# EAGLE schematic Teensy_v1 (EAGLE 7.7.0)
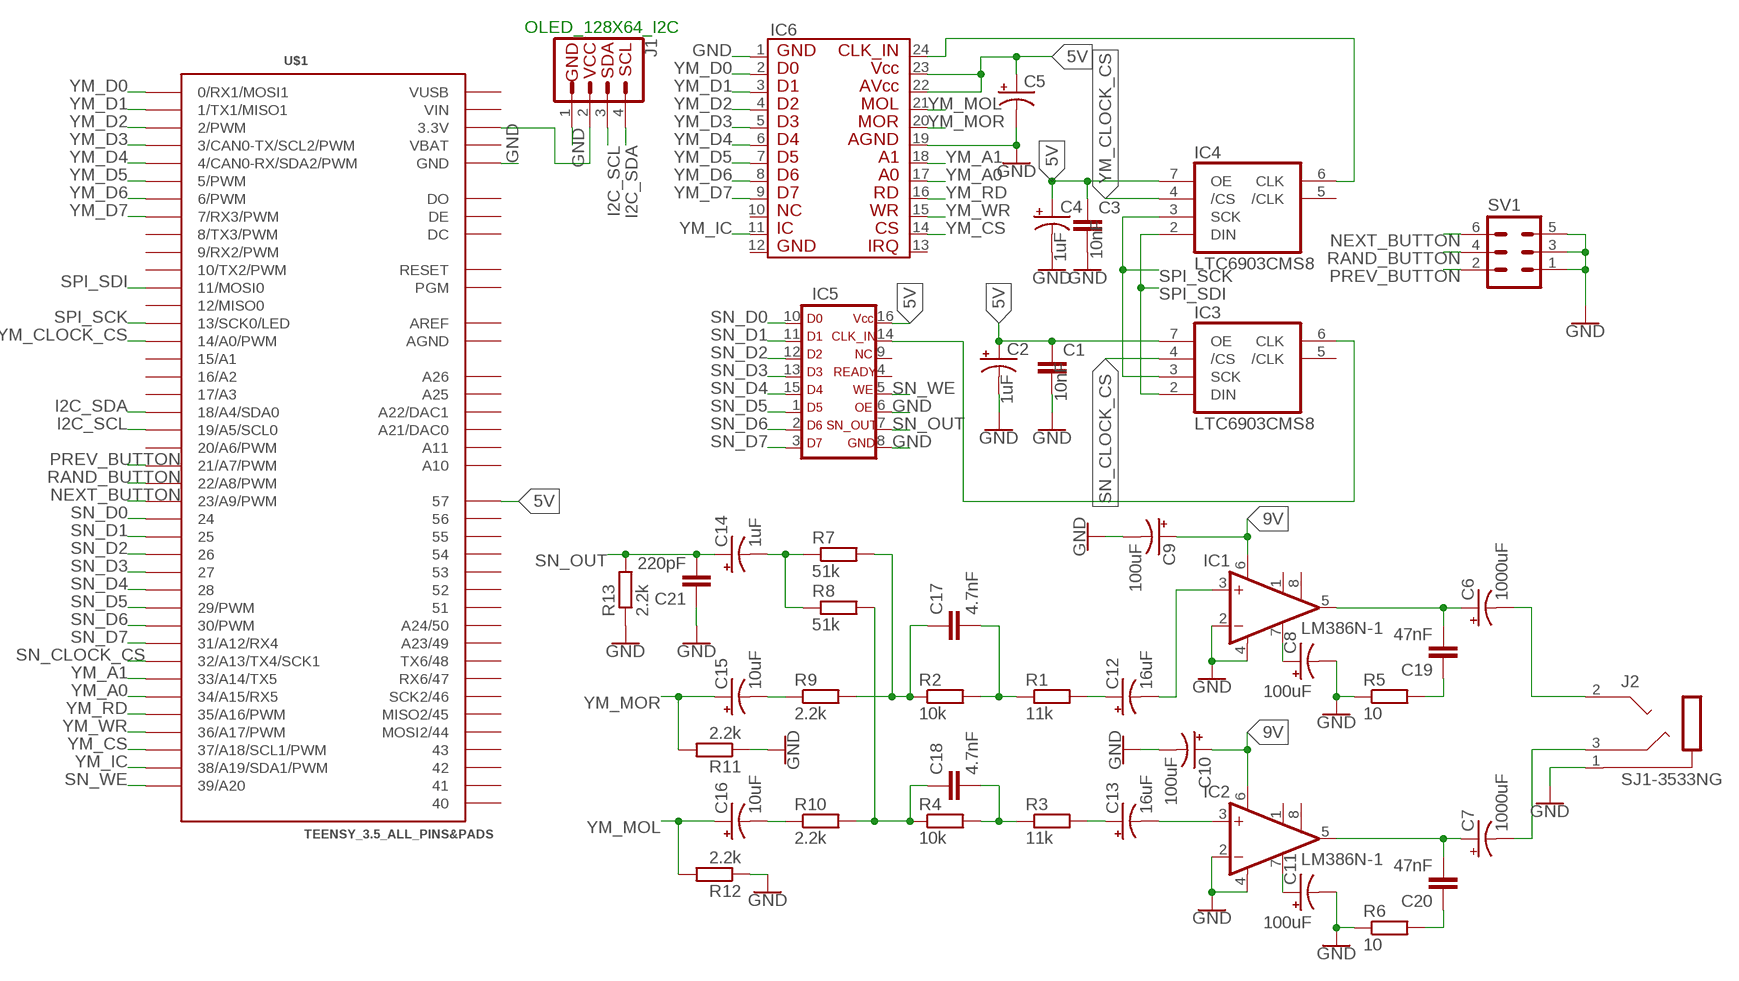
[diagram p0: schematic, sheet 1]

## Parts
C1  10nF  C-EU025-025X050  [C025-025X050]
C2  1uF  CPOL-USE2-5  [E2-5]
C3  10nF  C-EU025-025X050  [C025-025X050]
C4  1uF  CPOL-USE2-5  [E2-5]
C5  1000uF  CPOL-USE5-10.5  [E5-10,5]
C6  1000uF  CPOL-USE5-10.5  [E5-10,5]
C7  1000uF  CPOL-USE5-10.5  [E5-10,5]
C8  100uF  CPOL-USE2-5  [E2-5]
C9  100uF  CPOL-USE2-5  [E2-5]
C10  100uF  CPOL-USE2-5  [E2-5]
C11  100uF  CPOL-USE2-5  [E2-5]
C12  16uF  CPOL-USE5-10.5  [E5-10,5]
C13  16uF  CPOL-USE5-10.5  [E5-10,5]
C14  1uF  CPOL-USE2-5  [E2-5]
C15  10uF  CPOL-USE2-5  [E2-5]
C16  10uF  CPOL-USE2-5  [E2-5]
C17  4.7nF  C-EU025-025X050  [C025-025X050]
C18  4.7nF  C-EU025-025X050  [C025-025X050]
C19  47nF  C-EU025-025X050  [C025-025X050]
C20  47nF  C-EU025-025X050  [C025-025X050]
C21  220pF  C-EU025-025X050  [C025-025X050]
IC1  LM386N-1  [DIL08]
IC2  LM386N-1  [DIL08]
IC3  LTC6903CMS8  [MSOP8]
IC4  LTC6903CMS8  [MSOP8]
IC5  SN76489*  [SOCKET-16]
IC6  YM2612-6  [DIL24-6]
J1  I2C_STANDARD  [1X04]
J2  SJ1-3533NG  [SJ1-3533NG]
R1  11k  R-EU_0204/7  [0204/7]
R2  10k  R-EU_0204/7  [0204/7]
R3  11k  R-EU_0204/7  [0204/7]
R4  10k  R-EU_0204/7  [0204/7]
R5  10  R-EU_0204/7  [0204/7]
R6  10  R-EU_0204/7  [0204/7]
R7  51k  R-EU_0204/7  [0204/7]
R8  51k  R-EU_0204/7  [0204/7]
R9  2.2k  R-EU_0204/7  [0204/7]
R10  2.2k  R-EU_0204/7  [0204/7]
R11  2.2k  R-EU_0204/7  [0204/7]
R12  2.2k  R-EU_0204/7  [0204/7]
R13  2.2k  R-EU_0204/7  [0204/7]
SV1  MA03-2  [MA03-2]
U$1  TEENSY_3.5_ALL_PINS&PADS  [TEENSY_3.5_ALL_PINS&PADS]

## Nets
5V: C1.1 C2.+ C3.1 C4.+ C5.+ IC3.7(OE) IC4.7(OE) IC5.16(V) IC6.22 IC6.23 U$1.57
9V: C9.+ C10.+ IC1.6(VS) IC2.6(VS)
GND: C1.2 C2.- C3.2 C4.- C5.- C8.- C9.- C10.- C11.- C21.1 IC1.2(-IN) IC1.4(GND) IC2.2(-IN) IC2.4(GND) IC5.6(OE) IC5.8(GND) IC6.1 IC6.19 J1.1 J2.1(S) R5.1 R6.1 R11.1 R12.1 R13.1 SV1.1 SV1.3 SV1.5 U$1.GND U$1.GND1(GND) U$1.GND2(GND) U$1.GND3(GND) U$1.GND4(GND) U$1.GND5(GND) U$1.GND6(GND)
I2C_SCL: J1.3 U$1.19/A5(19/A5/SCL0)
I2C_SDA: J1.4 U$1.18/A4(18/A4/SDA0)
N$1: J1.2 U$1.3.3V U$1.3.3V2(3.3V) U$1.3.3V3(3.3V) U$1.3.3V4(3.3V)
N$2: IC4.6(CLK) IC6.24
N$3: C12.+ R1.2
N$4: C7.- J2.3(R)
N$5: C6.- J2.2(T)
N$6: C6.+ C19.2 IC1.5(OUT)
N$7: C7.+ C20.2 IC2.5(OUT)
N$8: C8.+ IC1.7(BYPASS)
N$9: C11.+ IC2.7(BYPASS)
N$10: C13.+ R3.2
N$11: IC3.6(CLK) IC5.14(CLK)
N$12: C19.1 R5.2
N$13: C17.2 R1.1 R2.2
N$14: C18.2 R3.1 R4.2
N$15: C12.- IC1.3(+IN)
N$16: C13.- IC2.3(+IN)
N$17: C20.1 R6.2
N$19: C17.1 R2.1 R7.2 R9.2
N$21: C18.1 R4.1 R8.2 R10.2
N$22: C14.- R7.1 R8.1
N$23: C15.- R9.1
N$24: C16.- R10.1
NEXT_BUTTON: U$1.23/A9(23/A9/PWM)
PREV_BUTTON: U$1.21/A7(21/A7/PWM)
RAND_BUTTON: U$1.22/A8(22/A8/PWM)
SN_CLOCK_CS: IC3.4(/CS) U$1.32/A13(32/A13/TX4/SCK1)
SN_D0: IC5.10(D0) U$1.24
SN_D1: IC5.11(D1) U$1.25
SN_D2: IC5.12(D2) U$1.26
SN_D3: IC5.13(D3) U$1.27
SN_D4: IC5.15(D4) U$1.28
SN_D5: IC5.1(D5) U$1.29(29/PWM)
SN_D6: IC5.2(D6) U$1.30(30/PWM)
SN_D7: IC5.3(D7) U$1.31/A12(31/A12/RX4)
SN_OUT: C14.+ C21.2 IC5.7(SN) R13.2
SN_WE: IC5.5(WE) U$1.39/A20
SPI_SCK: IC3.3(SCK) IC4.3(SCK) U$1.13(13/SCK0/LED)
SPI_SDI: IC3.2(DIN) IC4.2(DIN) U$1.11(11/MOSI0)
YM_A0: IC6.17 U$1.34/A15(34/A15/RX5)
YM_A1: IC6.18 U$1.33/A14(33/A14/TX5)
YM_CLOCK_CS: IC4.4(/CS) U$1.14/A0(14/A0/PWM)
YM_CS: IC6.14 U$1.37/A18(37/A18/SCL1/PWM)
YM_D0: IC6.2 U$1.0(0/RX1/MOSI1)
YM_D1: IC6.3 U$1.1(1/TX1/MISO1)
YM_D2: IC6.4 U$1.2(2/PWM)
YM_D3: IC6.5 U$1.3(3/CAN0-TX/SCL2/PWM)
YM_D4: IC6.6 U$1.4(4/CAN0-RX/SDA2/PWM)
YM_D5: IC6.7 U$1.5(5/PWM)
YM_D6: IC6.8 U$1.6(6/PWM)
YM_D7: IC6.9 U$1.7(7/RX3/PWM)
YM_IC: IC6.11 U$1.38/A19(38/A19/SDA1/PWM)
YM_MOL: C16.+ IC6.21 R12.2
YM_MOR: C15.+ IC6.20 R11.2
YM_RD: IC6.16 U$1.35/A16(35/A16/PWM)
YM_WR: IC6.15 U$1.36/A17(36/A17/PWM)
Unconnected: IC1.1(GAIN) IC1.8(GAIN) IC2.1(GAIN) IC2.8(GAIN) IC3.5(/CLK) IC4.5(/CLK) IC5.4(RDY) IC5.9(NC) IC6.10 IC6.12 IC6.13 SV1.2 SV1.4 SV1.6 U$1.8(8/TX3/PWM) U$1.9(9/RX2/PWM) U$1.10(10/TX2/PWM) U$1.12(12/MISO0) U$1.15/A1 U$1.16/A2 U$1.17/A3 U$1.20/A6(20/A6/PWM) U$1.40 U$1.41 U$1.42 U$1.43 U$1.44(MOSI2/44) U$1.45(MISO2/45) U$1.46(SCK2/46) U$1.47(RX6/47) U$1.48(TX6/48) U$1.49(A23/49) U$1.50(A24/50) U$1.51 U$1.52 U$1.53 U$1.54 U$1.55 U$1.56 U$1.A10 U$1.A11 U$1.A21(A21/DAC0) U$1.A22(A22/DAC1) U$1.A25 U$1.A26 U$1.DC U$1.DE U$1.DO U$1.PGM U$1.RESET

## Notes on the sheet
- OLED_128X64_I2C

## Power pins joined to a net without a drawn wire
AGND: U$1.AGND
AREF: U$1.AREF
GND: IC3.1(GND) IC4.1(GND)
VBAT: U$1.VBAT
VCC: IC3.8(VCC) IC4.8(VCC)
VIN: U$1.VIN
VUSB: U$1.VUSB

## Library data of the parts
C1 C3 C17-C21 = resistor:C-EU: CAPACITOR, European symbol
C2 C4-C16 = resistor:CPOL-US: POLARIZED CAPACITOR, American symbol
IC1 IC2 = linear:LM386?-*: Low Voltage Audio Power Amplifier Source: http://cache.national.com/ds/LM/LM386.pdf
IC3 IC4 = linear-technology-3:LTC6903*: 1kHz - 68MHz Serial Port Programmable Oscillator SPI Interface
IC5 = Sega:SN76489: Dual In Line / Socket
IC6 = Sega:YM2612: YM2612 Sound chip found in the Sega Genesis 24 DIP Package (OBN2)
J1 = SparkFun-Connectors:I2C_STANDARD: SparkFun I2C Standard Pinout Header SparkFun has standardized on a pinout for all I2C based sensor breakouts. This pinout allows I2C boards to be plugged directly into the headers on Arduino Uno compatible boards, and to be daisy chained easily. Example SparkFun Products: SparkFun Atmospheric Sensor Breakout - BME280 <https://www.sparkfun.com/products/13676> SparkFun Altitude/Pressure Sensor Breakout - MPL3115A2 <https://www.sparkfun.com/products/11084> SparkFun TOF Range Finder Sensor - VL6180 <https://www.sparkfun.com/products/12785>
J2 = SJ1-3533NG:SJ1-3533NG: RIGHT ANGLE STEREO JACK 3.5mm; AVAILABILITY: Good; DESCRIPTION: SJ1 Series 3.5 mm 12 V Right Angle Through Hole Isolated Stereo Audio Jack; MF: CUI; MP: SJ1-3533NG; PACKAGE: None; PRICE: 0.77 USD
R1-R13 = resistor:R-EU_: RESISTOR, European symbol
SV1 = con-lstb:MA03-2: PIN HEADER; OC_FARNELL: unknown; OC_NEWARK: unknown
U$1 = Teensy_3_and_LC_Series_Boards_v1.4:TEENSY_3.5_ALL_PINS&PADS: All pins and pads on the Teensy 3.5 exposed. Assumes the use of multiple, unshrouded headers to get access to the pads on the underside of the Teensy These headers should be a 2x5, 2x4, and a 2x3 with a 0.1" hole spacing / pitch.

## Net classes
0 default: width 0.508 mm